# Altium schematic sheet ROM.SchDoc
size A4; SheetNumber: 2; SheetTotal: 11
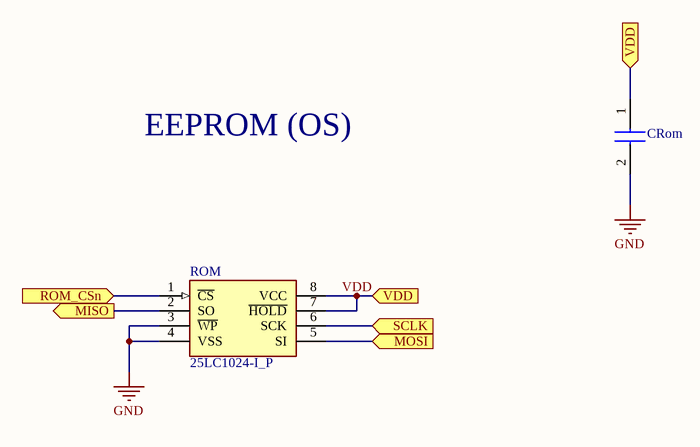
[diagram p0: ROM.SchDoc]

## Parts
CRom  GRM155R71C104JA88D  [CAPC1005X55N]  (value not drawn)
ROM  25LC1024-I_P  [DIP781W56P254L950H533Q8N]

## Ports
MISO (out), MOSI (in), ROM_CSn (in), SCLK (in), VDD (in)

## Nets
GND: CRom.2 ROM.3(~{WP}) ROM.4(VSS)
MISO: ROM.2(SO) ; port MISO
MOSI: ROM.5(SI) ; port MOSI
ROM_CSn: ROM.1(~{CS}) ; port ROM_CSn
SCLK: ROM.6(SCK) ; port SCLK
VDD: CRom.1 ROM.7(~{HOLD}) ROM.8(VCC) ; port VDD

## Notes on the sheet
- EEPROM (OS)

## Library data of the parts
CRom = GRM155R71C104JA88D: Capacitor; Manufacturer_Name: Murata Electronics; Datasheet Link: http://www.murata.com/~/media/webrenewal/support/library/catalog/products/capacitor/mlcc/c02e.pdf; Height: 0.55mm; Manufacturer_Part_Number: GRM155R71C104JA88D; Mouser Part Number: 81-GRM155R71C104JA8D; Mouser Price/Stock: https://www.mouser.co.uk/ProductDetail/Murata-Electronics/GRM155R71C104JA88D?qs=pwh76yelNxDjPOceoz6xEg%3D%3D; Arrow Part Number: GRM155R71C104JA88D; Arrow Price/Stock: https://www.arrow.com/en/products/grm155r71c104ja88d/murata-manufacturing?region=nac
ROM = 25LC1024-I_P: Integrated Circuit; Manufacturer_Name: Microchip; Manufacturer_Part_Number: 25LC1024-I/P; Datasheet Link: http://ww1.microchip.com/downloads/en/DeviceDoc/22064D.pdf; Height: 5.334mm; Mouser Part Number: 579-25LC1024-I/P; Mouser Price/Stock: https://www.mouser.co.uk/ProductDetail/Microchip-Technology/25LC1024-I-P?qs=W2ndVjZwIII4HC8C0OcyMA%3D%3D; Arrow Part Number: 25LC1024-I/P; Arrow Price/Stock: https://www.arrow.com/en/products/25lc1024-ip/microchip-technology